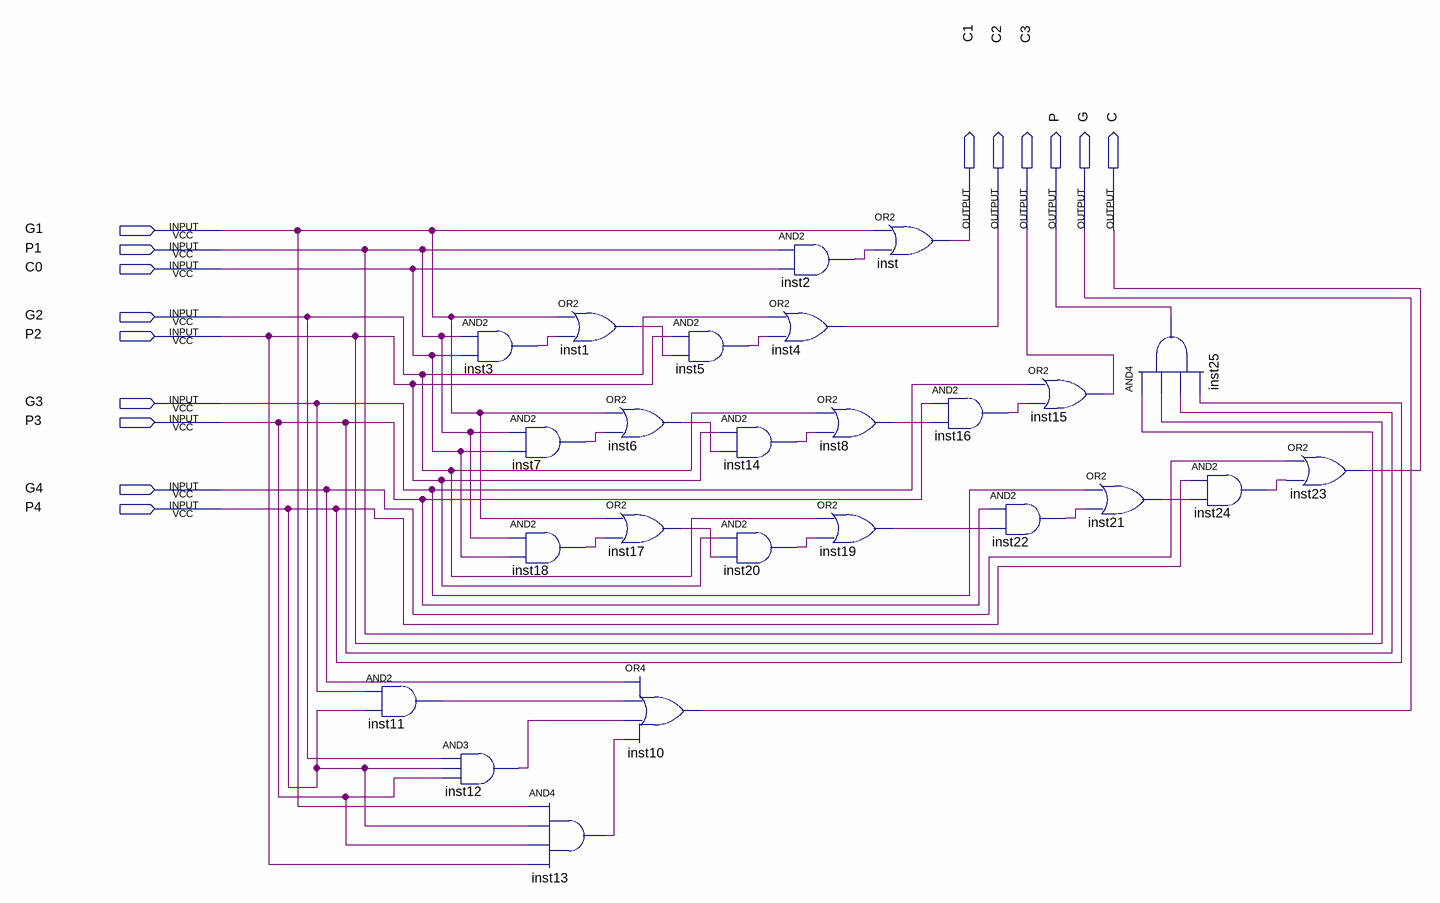
[diagram p0: schematic sheet]
// Quartus schematic carryLookaheadLogic2.bdf as structural Verilog: 25 symbols, 15 pins
module carryLookaheadLogic2 (
  input  G1,
  input  P1,
  input  C0,
  input  G2,
  input  P2,
  input  G3,
  input  P3,
  input  G4,
  input  P4,
  output C1,
  output C2,
  output C3,
  output P,
  output G,
  output C
);

  wire inst1_out, inst2_out, inst3_out, inst5_out, inst6_out, inst7_out, inst8_out, inst11_out, inst12_out,
       inst13_out, inst14_out, inst16_out, inst17_out, inst18_out, inst19_out, inst20_out, inst21_out,
       inst22_out, inst24_out;

  and inst11 (inst11_out, G3, P4);
  and inst3 (inst3_out, P1, C0);
  and inst12 (inst12_out, G2, P4, P3);
  and inst7 (inst7_out, P1, C0);
  and inst18 (inst18_out, P1, C0);
  and inst13 (inst13_out, G1, P4, P3, P2);
  or inst1 (inst1_out, G1, inst3_out);
  or inst6 (inst6_out, G1, inst7_out);
  or inst17 (inst17_out, G1, inst18_out);
  or inst10 (G, G4, inst11_out, inst12_out, inst13_out);
  and inst5 (inst5_out, P2, inst1_out);
  and inst2 (inst2_out, P1, C0);
  or inst4 (C2, G2, inst5_out);
  and inst14 (inst14_out, P2, inst6_out);
  and inst20 (inst20_out, P2, inst17_out);
  or inst8 (inst8_out, G2, inst14_out);
  or inst19 (inst19_out, G2, inst20_out);
  or inst (C1, G1, inst2_out);
  and inst16 (inst16_out, P3, inst8_out);
  and inst22 (inst22_out, P3, inst19_out);
  or inst15 (C3, G3, inst16_out);
  or inst21 (inst21_out, G3, inst22_out);
  and inst25 (P, P1, P2, P3, P4);
  and inst24 (inst24_out, P4, inst21_out);
  or inst23 (C, G4, inst24_out);
endmodule
